# EAGLE schematic Thetis-RevA1-SCH (EAGLE 9.7.0)
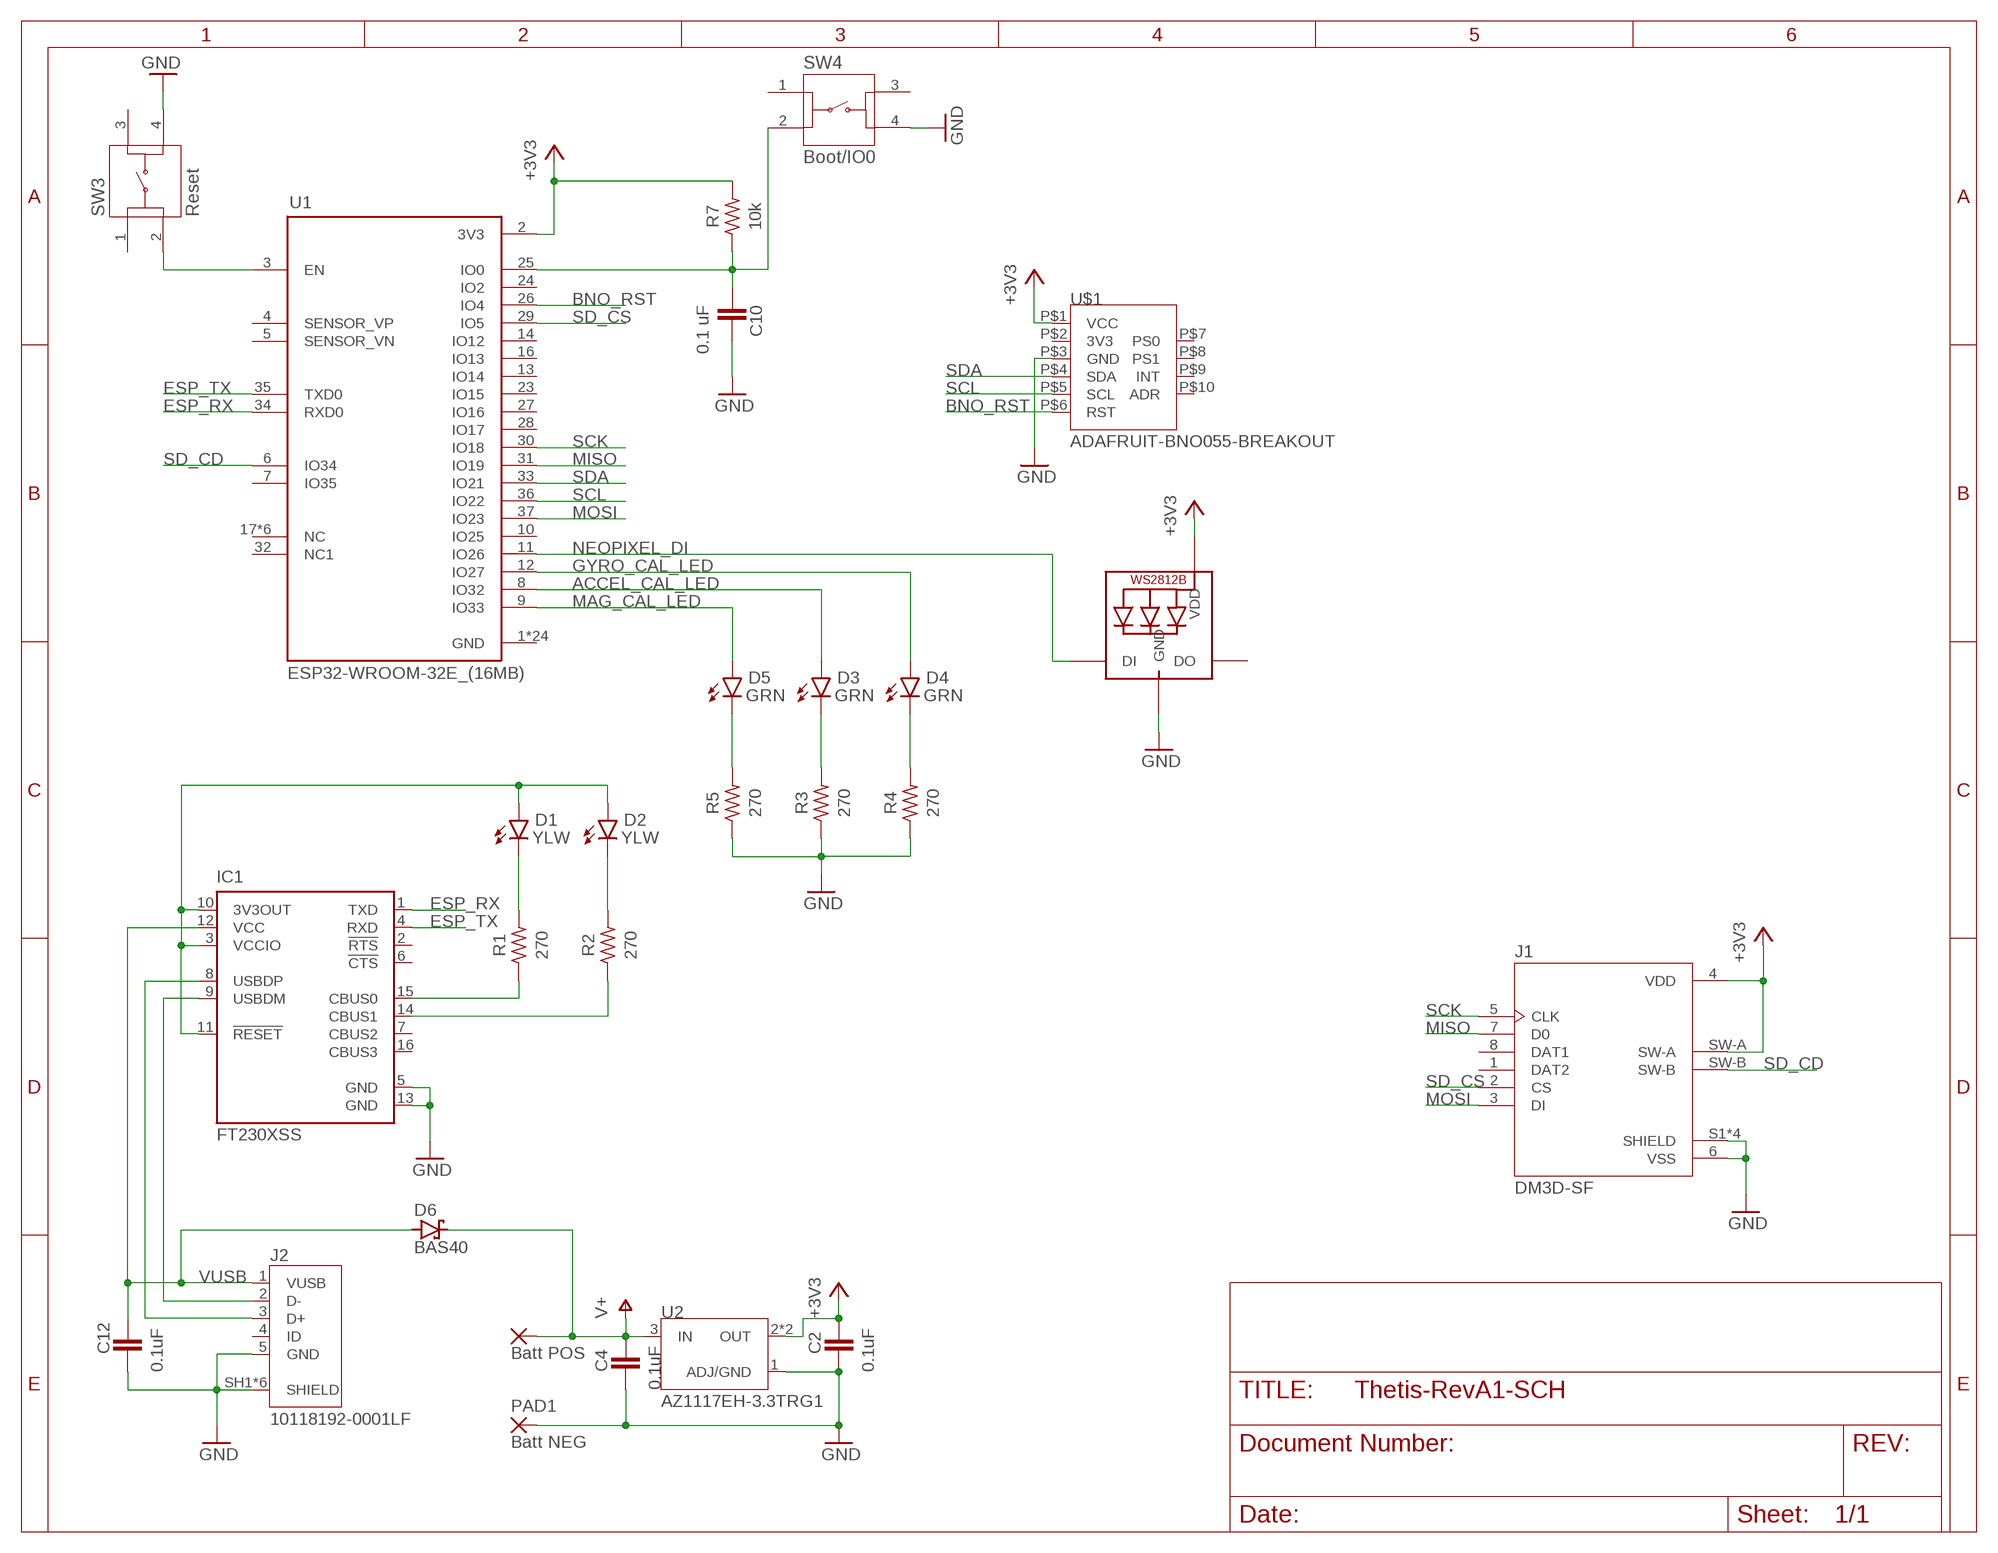
[diagram p0: schematic, sheet 1]

## Parts
C2  0.1uF  C_CHIP-0603(1608-METRIC)  [CAPC1608X85]
C4  0.1uF  C_CHIP-0603(1608-METRIC)  [CAPC1608X85]
C10  0.1 uF  C_CHIP-0603(1608-METRIC)  [CAPC1608X85]
C12  0.1uF  C_CHIP-0603(1608-METRIC)  [CAPC1608X85]
D1  YLW  CHIP-FLAT-Y_0603-0.35MM  [LEDC1608X35N]
D2  YLW  CHIP-FLAT-Y_0603-0.35MM  [LEDC1608X35N]
D3  GRN  CHIP-FLAT-Y_0603-0.35MM  [LEDC1608X35N]
D4  GRN  CHIP-FLAT-Y_0603-0.35MM  [LEDC1608X35N]
D5  GRN  CHIP-FLAT-Y_0603-0.35MM  [LEDC1608X35N]
D6  BAS40  [SOT23]
IC1  FT230XSS  [SSOP16]
J1  DM3D-SF  [HRS_DM3D-SF]
J2  10118192-0001LF  [AMPHENOL_10118192-0001LF]
LED2  WS2812B_5050N  [WS2812B-NARROW]
PAD1  Batt NEG  SMD5  [SMD2,54-5,08]
PAD2  Batt POS  SMD5  [SMD2,54-5,08]
R1  270  R-US_CHIP-0603(1608-METRIC)  [RESC1608X60]
R2  270  R-US_CHIP-0603(1608-METRIC)  [RESC1608X60]
R3  270  R-US_CHIP-0603(1608-METRIC)  [RESC1608X60]
R4  270  R-US_CHIP-0603(1608-METRIC)  [RESC1608X60]
R5  270  R-US_CHIP-0603(1608-METRIC)  [RESC1608X60]
R7  10k  R-US_CHIP-0603(1608-METRIC)  [RESC1608X60]
SW3  Reset  1825910-6  [SW_1825910-6-4]
SW4  Boot/IO0  1825910-6  [SW_1825910-6-4]
U1  ESP32-WROOM-32E_(16MB)  [MODULE_ESP32-WROOM-32E_(16MB)]
U2  AZ1117EH-3.3TRG1  AZ1117EH-5.0TRG1  [SOT230P700X180-4N]
U$1  ADAFRUIT-BNO055-BREAKOUT  [ADAFRUIT-BNO055-BREAKOUT]

## Nets
+3V3: C2.1 J1.4(VDD) J1.SW-A LED2.1-VDD(VDD) R7.2 U1.2(3V3) U2.2(OUT) U2.4(OUT) U$1.P$1(VCC)
ACCEL_CAL_LED: D3.A U1.8(IO32)
BNO_RST: U1.26(IO4) U$1.P$6(RST)
ESP_RX: IC1.1(TXD) U1.34(RXD0)
ESP_TX: IC1.4(RXD) U1.35(TXD0)
GND: C2.2 C4.2 C10.1 C12.2 IC1.5(GND) IC1.13(GND) J1.6(VSS) J1.S1(SHIELD) J1.S2(SHIELD) J1.S3(SHIELD) J1.S4(SHIELD) J2.5(GND) J2.SH1(SHIELD) J2.SH2(SHIELD) J2.SH3(SHIELD) J2.SH4(SHIELD) J2.SH5(SHIELD) J2.SH6(SHIELD) LED2.3-GND(GND) PAD1.1(P) SW3.4 SW4.4 U2.1(ADJ/GND) U$1.P$3(GND)
GYRO_CAL_LED: D4.A U1.12(IO27)
MAG_CAL_LED: D5.A U1.9(IO33)
MISO: J1.7(D0) U1.31(IO19)
MOSI: J1.3(DI) U1.37(IO23)
N$1: D1.A D2.A IC1.3(VCCIO) IC1.10(3V3OUT) IC1.11(!RESET)
N$2: IC1.15(CBUS0) R1.1
N$3: IC1.14(CBUS1) R2.1
N$4: IC1.9(USBDM) J2.2(D-)
N$5: IC1.8(USBDP) J2.3(D+)
N$6: D1.C R1.2
N$7: D2.C R2.2
N$10: R3.1 R4.1 R5.1 ; supply symbol labelled GND
N$12: D3.C R3.2
N$13: D4.C R4.2
N$16: D5.C R5.2
N$20: SW3.2 U1.3(EN)
N$22: C10.2 R7.1 SW4.2 U1.25(IO0)
NEOPIXEL_DI: LED2.4-DIN(DI) U1.11(IO26)
SCK: J1.5(CLK) U1.30(IO18)
SCL: U1.36(IO22) U$1.P$5(SCL)
SD_CD: J1.SW-B U1.6(IO34)
SD_CS: J1.2(CS) U1.29(IO5)
SDA: U1.33(IO21) U$1.P$4(SDA)
V+: C4.1 D6.3(C) PAD2.1(P) U2.3(IN)
VUSB: C12.1 D6.1(A) IC1.12(VCC) J2.1(VUSB)
Unconnected: IC1.2(!RTS) IC1.6(!CTS) IC1.7(CBUS2) IC1.16(CBUS3) J1.1(DAT2) J1.8(DAT1) J2.4(ID) LED2.2-DOUT(DO) SW3.1 SW3.3 SW4.1 SW4.3 U1.4(SENSOR_VP) U1.5(SENSOR_VN) U1.7(IO35) U1.10(IO25) U1.13(IO14) U1.14(IO12) U1.16(IO13) U1.17(NC) U1.18(NC) U1.19(NC) U1.20(NC) U1.21(NC) U1.22(NC) U1.23(IO15) U1.24(IO2) U1.27(IO16) U1.28(IO17) U1.32(NC1) U$1.P$7(PS0) U$1.P$8(PS1) U$1.P$9(INT) U$1.P$10(ADR)

## Power pins joined to a net without a drawn wire
3V3: U$1.P$2(3V3)
GND: U1.1(GND) U1.15(GND) U1.38(GND) U1.39_1(GND) U1.39_2(GND) U1.39_3(GND) U1.39_4(GND) U1.39_5(GND) U1.39_6(GND) U1.39_7(GND) U1.39_8(GND) U1.39_9(GND) U1.39_10(GND) U1.39_11(GND) U1.39_12(GND) U1.39_13(GND) U1.39_14(GND) U1.39_15(GND) U1.39_16(GND) U1.39_17(GND) U1.39_18(GND) U1.39_19(GND) U1.39_20(GND) U1.39_21(GND)

## Library data of the parts
C2 C4 C10 C12 = Capacitor:C: Capacitor - Generic; CATEGORY: Capacitor
D1-D5 = LED:CHIP-FLAT-Y; CATEGORY: LED; COLOR: YELLOW; DESCRIPTION: CHIP LED FLAT; SUB-CATEGORY: CHIP; TYPE: FLAT_TOP
D6 = diode:BAS40: Silicon Schottky Diodes General-purpose diode for high-speed switching
IC1 = FT230XS:FT230XS: USB to BASIC UART IC Auto generated by make-symbol-device-package-bsdl.ulp Rev. 43 Source: Data sheet <http://www.ftdichip.com/Support/Documents/DataSheets/ICs/DS_FT230X.pdf>
J1 = DM3D-SF:DM3D-SF: Right Angle SMT Top Board Mount Push-Pull No Ejection MicroSD Connector; MANUFACTURER: Hirose; MAXIMUM_PACKAGE_HEIGHT: 1.55mm; PARTREV: 2017.1; STANDARD: Manufacturer Recommendations
J2 = Amphenol-MicroUSB:10118192-0001LF: Single Port 5 Contact Horizontal Right Angle Shielded Micro B USB 2.0 Connector; MANUFACTURER: Amphenol; PARTREV: B; STANDARD: Manufacturer Recommendation
LED2 = adafruit - EVE Edit:WS2812B
PAD1 PAD2 = wirepad:SMD5: SMD PAD
R1-R5 R7 = Resistor:R-US: Resistor Fixed - ANSI; CATEGORY: Resistor; SUB-CATEGORY: Fixed
SW3 SW4 = Micro Button:1825910-6: Switch Tactile OFF (ON) SPST Round Button PC Pins 0.05A 24VDC 100000Cycles 1.57N Thru-Hole Loose; COMMENT: 1825910-6; CONFIGURATION_POLE-THROW: Single Pole - Single Throw; CONTACT_CURRENT_RATING: 50 mA; EU_ROHS_COMPLIANCE: Compliant
U1 = ESP32-WROOM-32E:ESP32-WROOM-32E_(16MB): Bluetooth, WiFi 802.11b/g/n, Bluetooth v4.2 +EDR, Class 1, 2 and 3 Transceiver Module 2.4GHz ~ 2.5GHz Integrated, Trace Surface Mount; MANUFACTURER: Espressif Systems; MAXIMUM_PACKAGE_HEIGHT: 3.25mm; PARTREV: 1.1; STANDARD: Manufacturer Recommendations
U2 = AZ1117EH-5.0TRG1:AZ1117EH-5.0TRG1; ARROW_ELECTRONICS-PURCHASE-URL: https://snapeda.com/shop?store=Arrow+Electronics&id=482930; AVAILABILITY: Good; DESCRIPTION: Linear Voltage Regulator IC 1 Output 1A SOT-223; DIGIKEY-PURCHASE-URL: https://snapeda.com/shop?store=DigiKey&id=482930; MF: Diodes Inc.; MOUSER-PURCHASE-URL: https://snapeda.com/shop?store=Mouser&id=482930; MP: AZ1117EH-5.0TRG1; PACKAGE: SOT-223 Diodes Inc.; PRICE: None
U$1 = EVE-ECAD-Library:ADAFRUIT-BNO055-BREAKOUT